# EasyEDA schematic IoT-Main Board.json
TITLE: Sheet_1; REV: 1.0; Date: 2023-12-27; Sheet: 1/1; Drawn By: Talha Ahmad; Company: Your Company
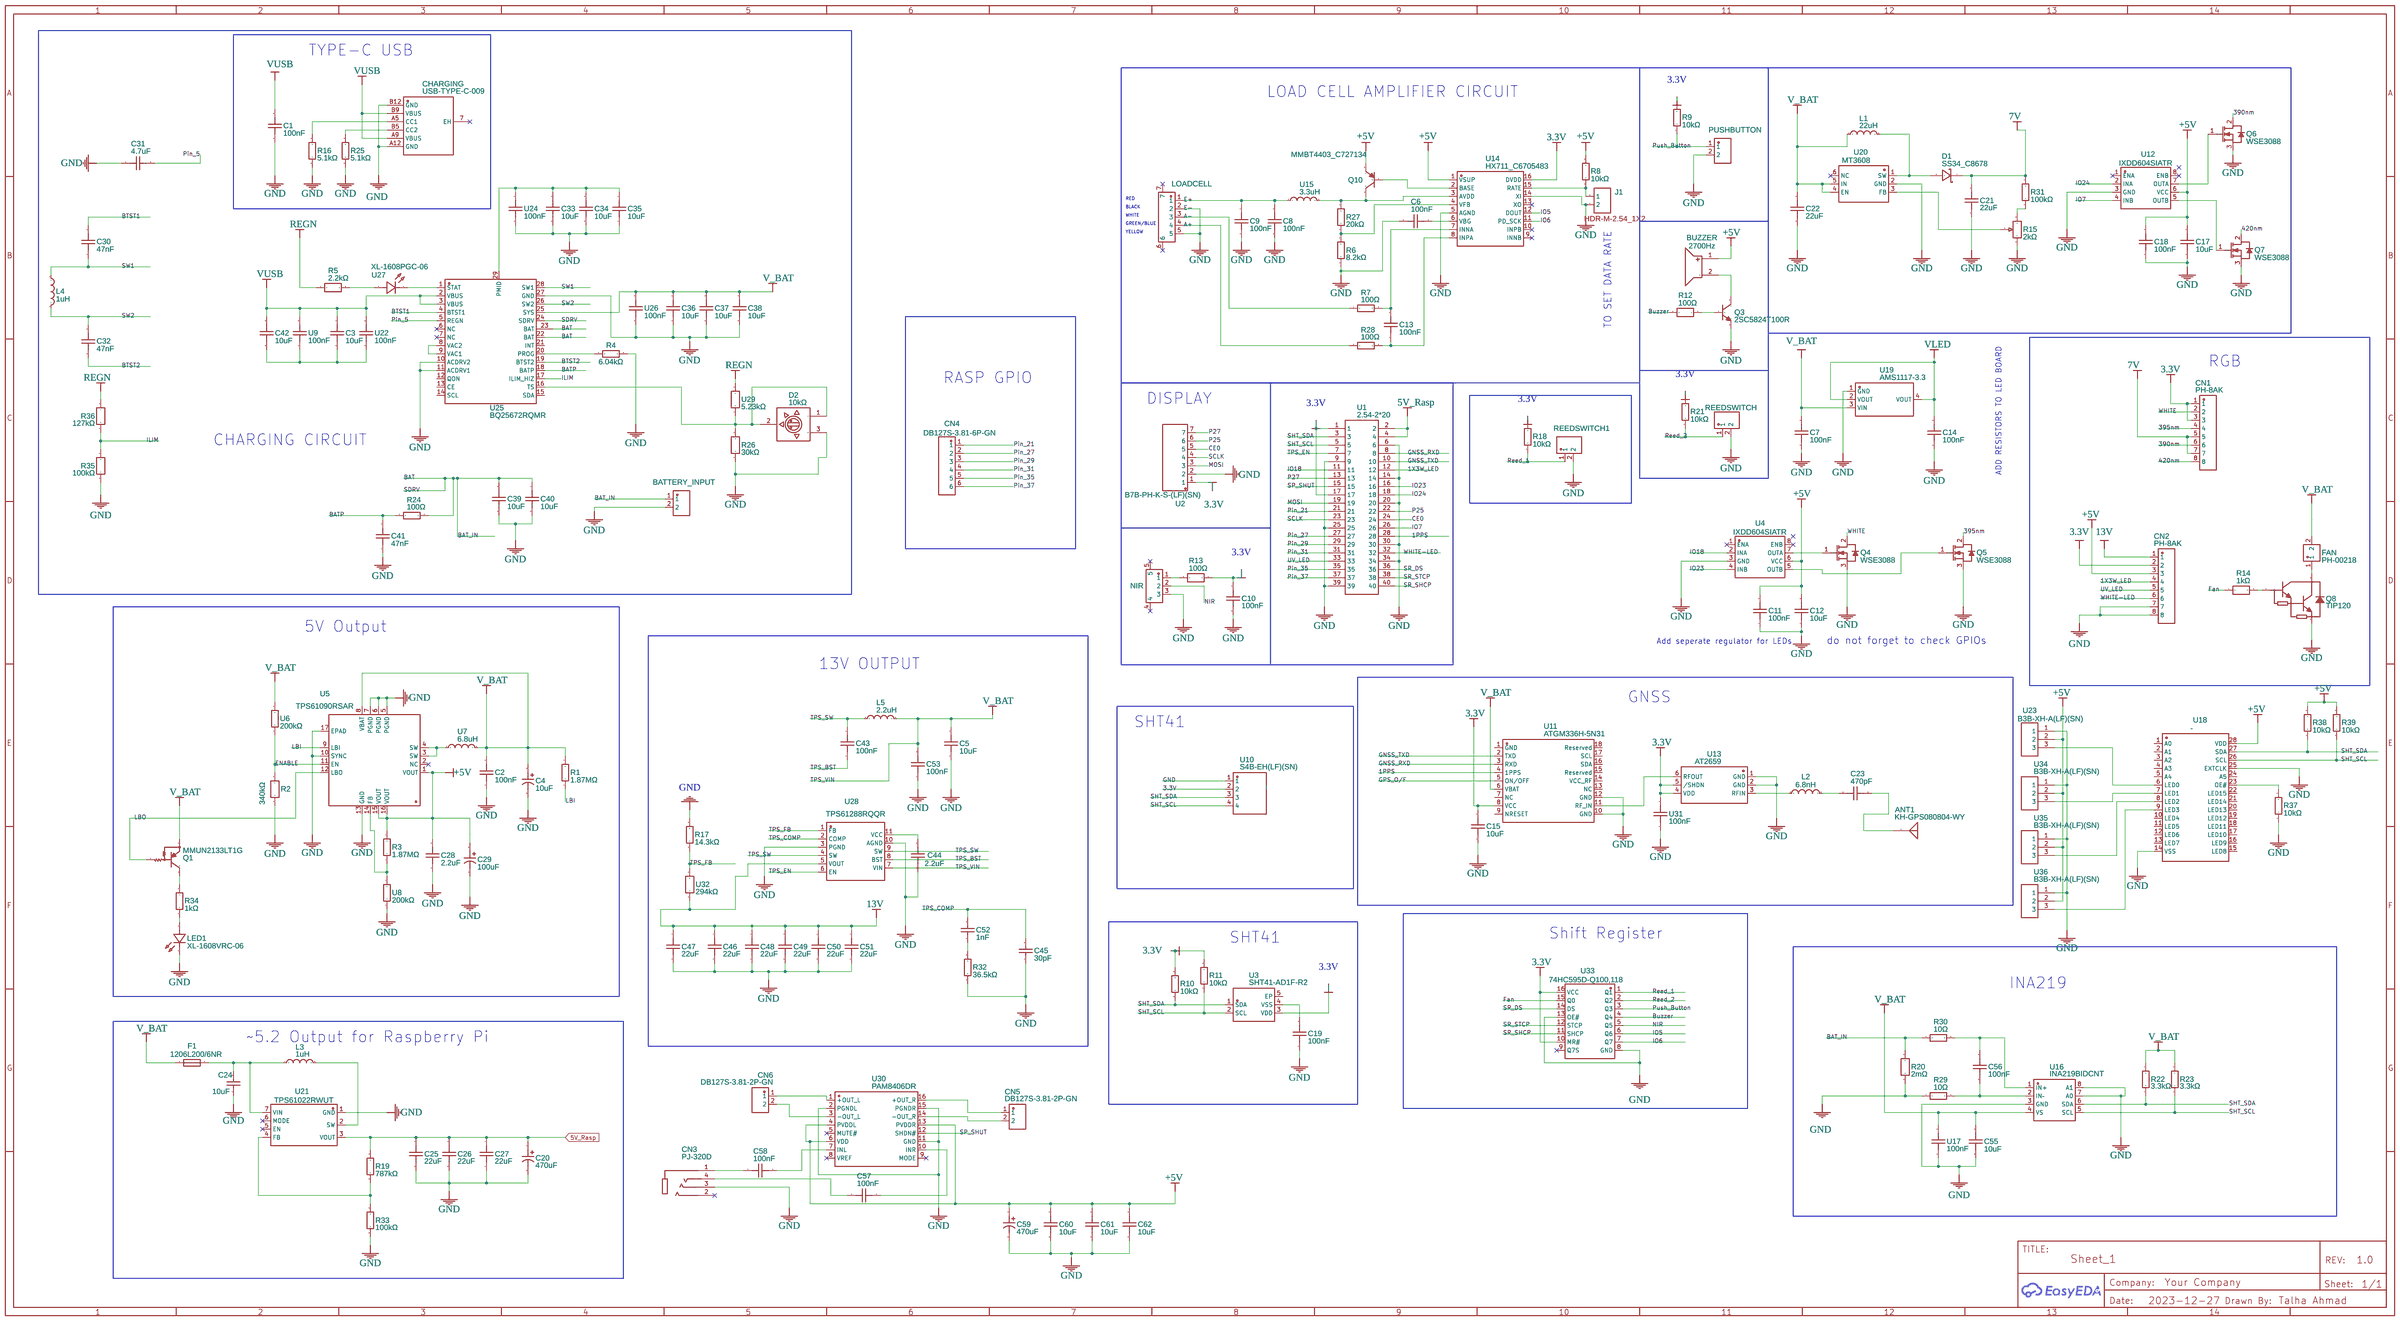
[diagram p0: schematic sheet]

## Parts
ANT1  KH-GPS080804-WY  [ANT-TH_L8.1-W8.1_KH-GPS121204-WY]
BATTERY_INPUT  PH-2A_C722767  [CONN-TH_PH-2A]
BUZZER  2700Hz  [BUZ-TH_BD9.0-P4.00-D0.6-FD]
C1  100nF  [C0603]
C2  100nF  [C0603]
C3  10uF  [C0603]
C4  10uF  [CAP-SMD_BD4.0-L4.3-W4.3-FD-LS5.3]
C5  10uF  [C0603]
C6  100nF  [C0603]
C7  100nF  [C0603]
C8  100nF  [C0603]
C9  100nF  [C0603]
C10  100nF  [C0603]
C11  100nF  [C0603]
C12  10uF  [C0603]
C13  100nF  [C0603]
C14  100nF  [C0603]
C15  10uF  [C0603]
C17  10uF  [C0603]
C18  100nF  [C0603]
C19  100nF  [C0603]
C20  470uF  [CAP-SMD_BD6.3-L6.6-W6.6-FD]
C21  22uF  [C0805]
C22  22uF  [C0805]
C23  470pF  [C0603]
C24  10uF  [C0603]
C25  22uF  [C0603]
C26  22uF  [C0603]
C27  22uF  [C0603]
C28  2.2uF  [C0402]
C29  100uF  [CAP-SMD_BD6.3-L6.6-W6.6-LS7.4-FD]
C30  47nF  [C0603]
C31  4.7uF  [C0603]
C32  47nF  [C0603]
C33  10uF  [C0603]
C34  10uF  [C0603]
C35  10uF  [C0603]
C36  10uF  [C0603]
C37  10uF  [C0603]
C38  10uF  [C0603]
C39  10uF  [C0603]
C40  10uF  [C0603]
C41  47nF  [C0603]
C42  10uF  [C0603]
C43  100nF  [C0603]
C44  2.2uF  [C0402]
C45  30pF  [C0402]
C46  22uF  [C0603]
C47  22uF  [C0603]
C48  22uF  [C0603]
C49  22uF  [C0603]
C50  22uF  [C0603]
C51  22uF  [C0603]
C52  1nF  [C0402]
C53  100nF  [C0603]
C55  10uF  [C0603]
C56  100nF  [C0603]
C57  100nF  [C0603]
C58  100nF  [C0603]
C59  470uF  [CAP-SMD_BD6.3-L6.6-W6.6-FD]
C60  10uF  [C0603]
C61  10uF  [C0603]
C62  10uF  [C0603]
CHARGING  USB-TYPE-C-009  [TYPE-C-SMD_TYPE-C-6P]
CN1  PH-8AK  [CONN-TH_8P-P2.00_PH-8AK_C8888]
CN2  PH-8AK  [CONN-TH_8P-P2.00_PH-8AK_C8888]
CN3  PJ-320D  [AUDIO-SMD_PJ-320D]
CN4  DB127S-3.81-6P-GN  [CONN-TH_6P-P3.81_DIBO_DB127S-3.81-6P-GN]
CN5  DB127S-3.81-2P-GN  [CONN-TH_2P-P3.81_DIBO_DB127S-3.81-2P-GN]
CN6  DB127S-3.81-2P-GN  [CONN-TH_2P-P3.81_DIBO_DB127S-3.81-2P-GN]
D1  SS34_C8678  [SMA_L4.3-W2.6-LS5.2-RD]
D2  10kΩ  [RES-ADJ-SMD_3314G-1-103E]
F1  1206L200/6NR  [F1206]
FAN  PH-00218  [HDR-TH_P2.54-V-M-R1-C2-S2.54]
J1  HDR-M-2.54_1x2  [HDR-M-2.54_1X2]
L1  22uH  [IND-SMD_L6.0-W6.0]
L2  6.8nH  [L0603]
L3  1uH  [L0402]
L4  1uH  [L0402]
L5  2.2uH  [L0603]
LED1  XL-1608VRC-06  [LED0603-RD_PINK]
LOADCELL  HC-FPC-05-10-5RLTAG  [FPC-SMD_5P-P0.50_HCTL_HC-FPC-05-10-5RLTAG]
NIR  1.0K-LS-3PWB  [FPC-SMD_3P-P1.00_HDGC_1.0K-LS-3PWB]
PUSHBUTTON  PH-2A_C722767  [CONN-TH_PH-2A]
Q1  MMUN2133LT1G  [SOT-23-3_L2.9-W1.6-P1.90-LS2.8-BR]
Q3  2SC5824T100R  [SOT-89-3_L4.5-W2.5-P1.50-LS4.2-TL]
Q4  WSE3088  [SOT-89-3_L4.5-W2.5-P1.50-LS4.2-BR]
Q5  WSE3088  [SOT-89-3_L4.5-W2.5-P1.50-LS4.2-BR]
Q6  WSE3088  [SOT-89-3_L4.5-W2.5-P1.50-LS4.2-BR]
Q7  WSE3088  [SOT-89-3_L4.5-W2.5-P1.50-LS4.2-BR]
Q8  TIP120  [TO-220-3_L10.0-W4.5-P2.54-L]
Q10  MMBT4403_C727134  [SOT-23-3_L2.9-W1.3-P1.90-LS2.4-BR]
R1  1.87MΩ  [R0603]
R2  340kΩ  [R0402]
R3  1.87MΩ  [R0603]
R4  6.04kΩ  [R0402]
R5  2.2kΩ  [R0603]
R6  8.2kΩ  [R0805]
R7  100Ω  [R0603]
R8  10kΩ  [R0603]
R9  10kΩ  [R0603]
R10  10kΩ  [R0603]
R11  10kΩ  [R0603]
R12  100Ω  [R0603]
R13  100Ω  [R0603]
R14  1kΩ  [R0603]
R15  2kΩ  [RES-ADJ-TH_3P-L7.1-W6.9-P2.50-L_3362P]
R16  5.1kΩ  [R1206]
R17  14.3kΩ  [R0402]
R18  10kΩ  [R0603]
R19  787kΩ  [R0603]
R20  2mΩ  [RES-SMD_L6.4-W3.2-1]
R21  10kΩ  [R0603]
R22  3.3kΩ  [R0402]
R23  3.3kΩ  [R0402]
R24  100Ω  [R0603]
R25  5.1kΩ  [R1206]
R26  30kΩ  [R0603]
R27  20kΩ  [R0805]
R28  100Ω  [R0603]
R29  10Ω  [R0402]
R30  10Ω  [R0402]
R31  100kΩ  [R0603]
R32  36.5kΩ  [R0603]
R33  100kΩ  [R0603]
R34  1kΩ  [R0603]
R35  100kΩ  [RES-SMD_L1.6-W0.8_LRE0603-2CR004F5]
R36  127kΩ  [R0603]
R37  10kΩ  [R0603]
R38  10kΩ  [R0603]
R39  10kΩ  [R0603]
REEDSWITCH  PH-2A_C722767  [CONN-TH_PH-2A]
REEDSWITCH1  PH-2A_C722767  [CONN-TH_PH-2A]
U1  2.54-2*20  [HDR-TH_40P-P2.54-V-F-R2-C20-S2.54]
U2  B7B-PH-K-S-(LF)(SN)  [CONN-TH_B7B-PH-K-S-LF-SN]
U3  SHT41-AD1F-R2  [DFN-4_L1.5-W1.5-P0.80-TL-EP]
U4  IXDD604SIATR  [SOIC-8_L5.0-W4.0-P1.27-LS6.0-BL]
U5  TPS61090RSAR  [QFN-16_L4.0-W4.0-P0.65-TL-EP2.7]
U6  200kΩ  [R0805]
U7  6.8uH  [IND-SMD_L4.5-W4.0]
U8  200kΩ  [R0805]
U9  100nF  [C1206]
U10  S4B-EH(LF)(SN)  [CONN-TH_S4B-EH-LF-SN]
U11  ATGM336H-5N31  [GPSM-SMD_ATGM336H-TR]
U12  IXDD604SIATR  [SOIC-8_L5.0-W4.0-P1.27-LS6.0-BL]
U13  AT2659  [DFN-6_L1.6-W1.0-P0.55-BL]
U14  HX711_C6705483  [SOP-16_L10.0-W3.9-P1.27-LS6.0-BL]
U15  3.3uH  [IND-SMD_L5.8-W5.2_CD54-4R7MT]
U16  INA219BIDCNT  [SOT-23-8_L2.9-W1.6-P0.65-LS2.8-BR]
U17  100nF  [C1206]
U18  -  [TSSOP-28_L9.7-W4.4-P0.65-LS6.4-BL]
U19  AMS1117-3.3  [SOT-223-3_L6.5-W3.4-P2.30-LS7.0-BR]
U20  MT3608  [SOT-23-6_L2.9-W1.6-P0.95-LS2.8-BL]
U21  TPS61022RWUT  [VQFN-7_L2.0-W2.0-P0.55-TL_RWU]
U22  100nF  [C1206]
U23  B3B-XH-A(LF)(SN)  [CONN-TH_3P-P2.50_A2501WV2-3P]
U24  100nF  [C1206]
U25  BQ25672RQMR  [VQFN-29_L4.0-W4.0-P0.40-BL]
U26  100nF  [C1206]
U27  XL-1608PGC-06  [LED0603-RD_GREEN]
U28  TPS61288RQQR  [VQFN-HR-11_L3.0-W2.5-P0.50-TL]
U29  5.23kΩ  [R0402]
U30  PAM8406DR  [SOIC-16_L9.9-W3.9-P1.27-LS6.0-BL]
U31  100nF  [C1206]
U32  294kΩ  [R0603]
U33  74HC595D-Q100,118  [SO-16_L9.9-W3.9-P1.27-LS6.0-BL]
U34  B3B-XH-A(LF)(SN)  [CONN-TH_3P-P2.50_A2501WV2-3P]
U35  B3B-XH-A(LF)(SN)  [CONN-TH_3P-P2.50_A2501WV2-3P]
U36  B3B-XH-A(LF)(SN)  [CONN-TH_3P-P2.50_A2501WV2-3P]

## Library data of the parts
ANT1 = KH-GPS080804-WY: Supplier: LCSC; Supplier Part: C962211; Manufacturer: kinghelm(金航标); JLCPCB Part Class: Extended Part; Contributor: lcsc
BATTERY_INPUT PUSHBUTTON REEDSWITCH REEDSWITCH1 = PH-2A_C722767: Contributor: LCSC; Supplier: LCSC; Supplier Part: C722767; Manufacturer: CAX(创都); Manufacturer Part: PH-2A; JLCPCB Part Class: Extended Part
BUZZER = QMB-09B-03: Contributor: LCSC; Supplier: LCSC; Manufacturer: 华能; Supplier Part: C96256; JLCPCB Part Class: Extended Part
C1 C2 C6-C11 C13 C14 C18 C19 C43 C53 C56-C58 = C0603B104K500NT: Supplier: LCSC; Supplier Part: C478888; Manufacturer: TORCH(火炬); Contributor: LCSC; JLCPCB Part Class: Extended Part
C3 C5 C15 C33-C40 C42 C55 C60-C62 = CL10A106KO8NQNC: Contributor: LCSC; Supplier: LCSC; Supplier Part: C962136; Manufacturer: SAMSUNG(三星); JLCPCB Part Class: Extended Part
C4 = EFVH025ADA100M0454: Supplier: LCSC; Supplier Part: C22387953; Manufacturer: FOLLON(富隆电子); JLCPCB Part Class: Extended Part; Contributor: lcsc
C12 C17 = CL10A106MA8NRNC: Supplier: LCSC; Manufacturer: SAMSUNG(三星); Supplier Part: C96446; JLCPCB Part Class: Basic Part
C20 C59 = RVE1A471M0605: Supplier: LCSC; Supplier Part: C7465562; Manufacturer: ROQANG(容强); Contributor: lcsc; JLCPCB Part Class: Extended Part
C21 C22 = CGA0805X5R226M350MT: Supplier: LCSC; Supplier Part: C6119901; Manufacturer: HRE(芯声); JLCPCB Part Class: Extended Part; Contributor: lcsc
C23 = CC0603KRX7R8BB471: Contributor: LCSC; Supplier: LCSC; Supplier Part: C519413; Manufacturer: YAGEO(国巨); JLCPCB Part Class: Extended Part
C24 = CL10A106MO8NQNC: Supplier: LCSC; Manufacturer: SAMSUNG(三星); Supplier Part: C92487; JLCPCB Part Class: Extended Part
C25-C27 C46-C51 = CL10A226MO7JZNC: Contributor: lcsc; Supplier: LCSC; Supplier Part: C2762594; Manufacturer: SAMSUNG(三星); JLCPCB Part Class: Extended Part
C28 = GRM155R61E225KE11D: Contributor: LCSC; Supplier: LCSC; Supplier Part: C385032; Manufacturer: muRata(村田)
C29 = FVM025ADA101M0654: Supplier: LCSC; Supplier Part: C7469933; Manufacturer: FOSAN(富信); Contributor: lcsc; JLCPCB Part Class: Extended Part
C30 C32 C41 = TCC0603X7R473M500CT: Contributor: LCSC; Supplier: LCSC; Supplier Part: C696860; Manufacturer: CCTC(三环); JLCPCB Part Class: Extended Part
C31 = TCC0603X5R475M250CT: Supplier: LCSC; Supplier Part: C20539423; Manufacturer: CCTC(三环); JLCPCB Part Class: Extended Part; Contributor: lcsc
C44 = EMK105ABJ225KV-F: Contributor: LCSC; Supplier: LCSC; Supplier Part: C385887; Manufacturer: TAIYO YUDEN(太诱)
C45 = CC0402JRNPO9BN300: Supplier: LCSC; Manufacturer: YAGEO(国巨); Supplier Part: C107004; JLCPCB Part Class: Extended Part
C52 = CC0402KRX7R9BB102: Contributor: LCSC; Supplier: LCSC; Manufacturer: YAGEO(国巨); Supplier Part: C106205; JLCPCB Part Class: Extended Part
CHARGING = USB-TYPE-C-009: Contributor: lcsc; Supplier: LCSC; Supplier Part: C2927029; Manufacturer: DEALON(德艺隆); JLCPCB Part Class: Extended Part
CN1 CN2 = PH-8AK: Supplier: LCSC; Manufacturer: BOOMELE(博穆精密); Supplier Part: C8888; JLCPCB Part Class: Extended Part
CN3 = PJ-320D: Contributor: LCSC; Supplier: LCSC; Supplier Part: C431535; Manufacturer: SHOU HAN(首韩); JLCPCB Part Class: Extended Part
CN4 = DB127S-3.81-6P-GN: Contributor: lcsc; Supplier: LCSC; Supplier Part: C2997518; Manufacturer: DORABO(地博电气); Manufacturer Part: DB127S-3.81-6P-GN-S; JLCPCB Part Class: Extended Part
CN5 CN6 = DB127S-3.81-2P-GN: Contributor: lcsc; Supplier: LCSC; Supplier Part: C2997514; Manufacturer: DORABO(地博电气); Manufacturer Part: DB127S-3.81-2P-GN-S
D1 = SS34_C8678: Supplier: LCSC; Manufacturer Part: SS34; Manufacturer: MDD; Supplier Part: C8678; JLCPCB Part Class: Basic Part
D2 = 3314G-1-103E: Contributor: LCSC; Supplier: LCSC; Supplier Part: C780220; Manufacturer: BOURNS; JLCPCB Part Class: Extended Part
F1 = 1206L200/6NR: Supplier: LCSC; Supplier Part: C19078715; Manufacturer: LUTE(陆特); JLCPCB Part Class: Extended Part; Contributor: lcsc
FAN = PH-00218: Contributor: LCSC; Supplier: LCSC; Supplier Part: C2685144; Manufacturer: Liansheng(连盛); JLCPCB Part Class: Extended Part
J1 = HDR-M-2.54_1x2: Supplier Part: C124375; Supplier: LCSC; Contributor: LCEDA_Lib; Package Display: Yes
L1 = PNLS6045-220M 22UH: Supplier: LCSC; Supplier Part: C2849539; Manufacturer: DMBJ(振宝佳); JLCPCB Part Class: Extended Part; Contributor: lcsc
L2 = CMCC1608C6N8JSP: Contributor: LCSC; Supplier: LCSC; Supplier Part: C405061; Manufacturer: Cybermax(思博科技); JLCPCB Part Class: Extended Part
L3 L4 = MLZ1005M1R0WT000: Contributor: LCSC; Supplier: LCSC; Supplier Part: C531288; Manufacturer: TDK; JLCPCB Part Class: Extended Part
L5 = MLZ1608N2R2LT000: Contributor: LCSC; Supplier: LCSC; Supplier Part: C531282; Manufacturer: TDK; JLCPCB Part Class: Extended Part
LED1 = XL-1608VRC-06: Supplier: LCSC; Supplier Part: C7371906; Manufacturer: XINGLIGHT(成兴光); JLCPCB Part Class: Extended Part; Contributor: lcsc
LOADCELL = HC-FPC-05-10-5RLTAG: Contributor: lcsc; Supplier: LCSC; Supplier Part: C5213728; Manufacturer: HCTL(华灿天禄); JLCPCB Part Class: Extended Part
NIR = 1.0K-LS-3PWB: Contributor: LCSC; Supplier: LCSC; Supplier Part: C2915456; Manufacturer: HDGC(华德共创); JLCPCB Part Class: Extended Part
Q1 = MMUN2133LT1G: Supplier: LCSC; Manufacturer: onsemi(安森美); Supplier Part: C86182; JLCPCB Part Class: Extended Part
Q3 = 2SC5824T100R: Supplier: LCSC; Manufacturer: ROHM(罗姆); Supplier Part: C126304; JLCPCB Part Class: Extended Part
Q4-Q7 = WSE3088: Supplier: LCSC; Supplier Part: C148358; Manufacturer: WINSOK(微硕); Contributor: LCSC; JLCPCB Part Class: Extended Part
Q8 = TIP120_C2992069: Contributor: lcsc; Supplier: LCSC; Supplier Part: C2992069; Manufacturer: CJ(江苏长电/长晶); JLCPCB Part Class: Extended Part
Q10 = MMBT4403_C727134: Contributor: LCSC; Supplier: LCSC; Supplier Part: C727134; Manufacturer: TWGMC(台湾迪嘉); Manufacturer Part: MMBT4403; JLCPCB Part Class: Extended Part
R1 R3 = 0603WAF1874T5E: Supplier: LCSC; Manufacturer: UNI-ROYAL(厚声); Supplier Part: C61679; JLCPCB Part Class: Extended Part
R2 = RC0402FR-07340KL: Contributor: LCSC; Supplier: LCSC; Supplier Part: C273336; Manufacturer: YAGEO(国巨); JLCPCB Part Class: Extended Part
R4 = RC0402FR-076K04L: Contributor: LCSC; Supplier: LCSC; Supplier Part: C97819; Manufacturer: YAGEO(国巨); JLCPCB Part Class: Extended Part
R5 = ERJUP3J222V: Contributor: LCSC; Supplier: LCSC; Supplier Part: C491201; Manufacturer: PANASONIC(松下); JLCPCB Part Class: Extended Part
R6 = RC0805JR-078K2L: Supplier: LCSC; Manufacturer: YAGEO(国巨); Supplier Part: C137399; JLCPCB Part Class: Extended Part
R7 R24 R28 = ESR03EZPJ101: Contributor: LCSC; Supplier: LCSC; Supplier Part: C253328; Manufacturer: ROHM(罗姆); JLCPCB Part Class: Extended Part
R8-R11 R18 R21 R37-R39 = ERA-3AEB103V: Contributor: LCSC; Supplier: LCSC; Supplier Part: C190610; Manufacturer: PANASONIC(松下); Manufacturer Part: ERA3AEB103V; JLCPCB Part Class: Extended Part
R12 R13 = ERJP03F1000V: Contributor: LCSC; Supplier: LCSC; Supplier Part: C427297; Manufacturer: PANASONIC(松下); JLCPCB Part Class: Extended Part
R14 = ERJUP3F1001V: Contributor: LCSC; Supplier: LCSC; Supplier Part: C491209; Manufacturer: PANASONIC(松下)
R15 = 3362P-1-202_C118929: Resistance(Ohms): 2K; Contributor: LCSC; Supplier: LCSC; Supplier Part: C118929; Manufacturer: BOCHEN(博晨); Manufacturer Part: 3362P-1-202; JLCPCB Part Class: Extended Part
R16 R25 = RC1206JR-075K1L: Contributor: LCSC; Supplier: LCSC; Manufacturer: YAGEO(国巨); Supplier Part: C131050; JLCPCB Part Class: Extended Part
R17 = RK73H1ETTP1432F: Contributor: LCSC; Supplier: LCSC; Supplier Part: C159950; Manufacturer: KOA; JLCPCB Part Class: Extended Part
R19 = CR0603F787KP05: Contributor: LCSC; Supplier: LCSC; Supplier Part: C245168; Manufacturer: EVER OHMS(天二科技); Manufacturer Part: CR0603F787KP05Z; JLCPCB Part Class: Extended Part
R20 = HOLLR2512-3W-2MR-1%: Contributor: lcsc; Supplier: LCSC; Supplier Part: C2994640; Manufacturer: Milliohm(毫欧); Manufacturer Part: HoLLR2512-3W-2mR-1%; JLCPCB Part Class: Extended Part
R22 R23 = RC0402FR-073K3L: Supplier: LCSC; Manufacturer: YAGEO(国巨); Supplier Part: C137992; JLCPCB Part Class: Extended Part
R26 = FRC0603F3002TS: Contributor: lcsc; Supplier: LCSC; Supplier Part: C2907025; Manufacturer: FOJAN(富捷); JLCPCB Part Class: Extended Part
R27 = RC0805JR-0720KL: Contributor: LCSC; Supplier: LCSC; Manufacturer: YAGEO(国巨); Supplier Part: C114233
R29 R30 = RC0402FR-0710RL: Supplier: LCSC; Manufacturer: YAGEO(国巨); Supplier Part: C138066; JLCPCB Part Class: Extended Part
R31 = ERJPB3D1003V: Contributor: LCSC; Supplier: LCSC; Supplier Part: C189496; Manufacturer: PANASONIC(松下); JLCPCB Part Class: Extended Part
R32 = RC0603FR-0736K5L: Supplier: LCSC; Manufacturer: YAGEO(国巨); Supplier Part: C137738; JLCPCB Part Class: Extended Part
R33 = RC0603FR-07100KL: Contributor: LCSC; Supplier: LCSC; Supplier Part: C14675; Manufacturer: YAGEO(国巨); JLCPCB Part Class: Extended Part
R34 = ESR03EZPJ102: Contributor: LCSC; JLCPCB Part Class: Extended Part; Supplier: LCSC; Supplier Part: C253329; Manufacturer: ROHM(罗姆)
R35 = CRCW0603100KFKEAHP: Supplier: LCSC; Supplier Part: C313647; Manufacturer: VISHAY(威世); JLCPCB Part Class: Extended Part; Contributor: lcsc
R36 = FRC0603F1273TS: Supplier: LCSC; Supplier Part: C2930062; Manufacturer: FOJAN(富捷); JLCPCB Part Class: Extended Part; Contributor: lcsc
U1 = 2.54-2*20: Contributor: LCSC; Supplier: LCSC; Supplier Part: C2977589; Manufacturer: ZHOURI(洲日); JLCPCB Part Class: Extended Part
U2 = B7B-PH-K-S-(LF)(SN): Contributor: LCSC; Supplier: LCSC; Supplier Part: C157981; Manufacturer: JST; Manufacturer Part: B7B-PH-K-S(LF)(SN)
U3 = SHT41-AD1F-R2: Supplier: LCSC; Supplier Part: C7461862; Manufacturer: Sensirion(瑞士盛思锐); Contributor: lcsc; Package Display: No
U4 U12 = IXDD604SIATR: Contributor: LCSC; Supplier: LCSC; Supplier Part: C2676942; Manufacturer: Littelfuse/IXYS; JLCPCB Part Class: Extended Part
U5 = TPS61090RSAR: Contributor: LCSC; Supplier: LCSC; Supplier Part: C206167; Manufacturer: TI(德州仪器); JLCPCB Part Class: Extended Part
U6 U8 = RTT052003FTP: Supplier: LCSC; Manufacturer: RALEC(旺诠); Supplier Part: C104082; JLCPCB Part Class: Extended Part
U7 = CY43-6.8UH: Contributor: lcsc; Supplier: LCSC; Supplier Part: C2929418; Manufacturer: SHOU HAN(首韩); JLCPCB Part Class: Extended Part
U9 U17 U22 U24 U26 U31 = CL31B104KBCNFNC: Supplier: LCSC; Supplier Part: C346231; Manufacturer: SAMSUNG(三星); JLCPCB Part Class: Extended Part; Contributor: lcsc
U10 = S4B-EH(LF)(SN): Contributor: LCSC; Supplier: LCSC; Supplier Part: C265068; Manufacturer: JST; JLCPCB Part Class: Extended Part
U11 = ATGM336H-5N31: Supplier: LCSC; Manufacturer: 杭州中科微; Supplier Part: C90770; JLCPCB Part Class: Extended Part
U13 = AT2659: Supplier: LCSC; Manufacturer: ZHONGKEWEI; Supplier Part: C92450; Contributor: armex; JLCPCB Part Class: Extended Part
U14 = HX711_C6705483: Contributor: lcsc; Supplier: LCSC; Supplier Part: C6705483; Manufacturer: AVIA(海芯科技); Manufacturer Part: HX711; JLCPCB Part Class: Extended Part
U15 = CY54-3.3UH: Contributor: lcsc; Supplier: LCSC; Supplier Part: C2929428; Manufacturer: SHOU HAN(首韩)
U16 = INA219BIDCNT: Contributor: lcsc; Supplier: LCSC; Supplier Part: C2653868; Manufacturer: TI(德州仪器); JLCPCB Part Class: Extended Part
U18 = PCA9685PW/Q900,118: Supplier: LCSC; Manufacturer: NXP(恩智浦); Supplier Part: C92206; JLCPCB Part Class: Extended Part
U19 = AMS1117-3.3: sourceId: dwIGgezVh; Supplier: LCSC; Manufacturer: AMS; Supplier Part: C6186; JLCPCB Part Class: Basic Part
U20 = MT3608: Supplier: LCSC; Manufacturer: 西安航天民芯; Supplier Part: C84817; JLCPCB Part Class: Extended Part
U21 = TPS61022RWUT: Contributor: LCSC; Supplier: LCSC; Supplier Part: C2071784; Manufacturer: TI(德州仪器); JLCPCB Part Class: Extended Part
U23 U34-U36 = B3B-XH-A(LF)(SN): Contributor: LCSC; Supplier: LCSC; Supplier Part: C144394; Manufacturer: JST; JLCPCB Part Class: Extended Part
U25 = BQ25672RQMR: Contributor: lcsc; Supplier: LCSC; Supplier Part: C3682029; Manufacturer: TI(德州仪器); JLCPCB Part Class: Extended Part
U27 = XL-1608PGC-06: Supplier: LCSC; Supplier Part: C7371905; Manufacturer: XINGLIGHT(成兴光); JLCPCB Part Class: Extended Part; Contributor: lcsc
U28 = TPS61288RQQR: Contributor: lcsc; Supplier: LCSC; Supplier Part: C5219223; Manufacturer: TI(德州仪器); JLCPCB Part Class: Extended Part
U29 = CRCW04025K23FKED: Supplier: LCSC; Supplier Part: C2076550; Manufacturer: VISHAY(威世); JLCPCB Part Class: Extended Part; Contributor: lcsc
U30 = PAM8406DR: Contributor: LCSC; Supplier: LCSC; Manufacturer: DIODES(美台); Supplier Part: C86270; JLCPCB Part Class: Extended Part
U32 = RT0603BRD07294KL: Supplier: LCSC; Supplier Part: C861286; Manufacturer: YAGEO(国巨); JLCPCB Part Class: Extended Part; Contributor: lcsc
U33 = 74HC595D-Q100,118: Contributor: LCSC; Supplier: LCSC; Supplier Part: C547127; Manufacturer: Nexperia(安世); JLCPCB Part Class: Extended Part

## Nets
3.3V: C10.1 C15.2 CN1.1 CN1.3 CN2.2 R9.2 R10.2 R11.2 R13.1 R18.2 R21.2 U1.1 U1.17 U2.1 U3.3(VDD) U10.2 U11.8(VCC) U13.4(VDD) U13.5(/SHDN) U14.16(DVDD) U31.2 U33.10(MR#) U33.16(VCC)
5V_Rasp: C20.1 C25.1 C26.1 C27.1 R19.2 U1.2 U1.4 U21.3(VOUT)
7V: C21.2 CN1.5 CN1.7 D1.1(K) R31.2
13V: C46.1 C47.1 C48.1 C49.1 C50.1 C51.1 CN2.1 U28.5(VOUT) U32.1
+5V: BUZZER.1 C11.2 C12.2 C17.2 C18.2 C28.2 C29.1 C59.1 C60.1 C61.1 C62.1 CN2.3 Q10.2(E) R3.2 R8.2 R38.2 R39.2 U4.6(VCC) U5.1(VOUT) U5.15(VOUT) U5.16(VOUT) U12.6(VCC) U14.1(VSUP) U18.28(VDD) U23.2 U30.4(PVDDL) U30.6(VDD) U30.13(PVDDR) U34.2 U35.2 U36.2
1PPS: U1.28 U11.4(1PPS)
1X3W_LED: CN2.4 U1.12
390nm: CN1.6 Q6.2(D)
395nm: CN1.4 Q5.2(D)
420nm: CN1.8 Q7.2(D)
A+: LOADCELL.4 R28.1
A-: LOADCELL.3 R7.1
BAT: BATTERY_INPUT.1 C39.1 C40.1 R20.2 R24.2 R30.1 U25.22(BAT) U25.23(BAT) U25.24(SDRV)
BATP: C41.2 R24.1 U25.18(BATP)
BTST1: C30.2 U25.4(BTST1)
BTST2: C32.1 U25.19(BTST2)
Buzzer: R12.2 U33.4(Q4)
CE0: U1.24 U2.5
E+: C8.2 C9.2 LOADCELL.1 U15.1
E-: BATTERY_INPUT.2 C1.1 C2.1 C4.2 C5.2 C6.2 C7.1 C8.1 C9.1 C10.2 C11.1 C12.1 C14.1 C15.1 C17.1 C18.1 C19.1 C20.2 C21.1 C22.1 C24.1 C25.2 C26.2 C27.2 C28.1 C29.2 C31.1 C33.2 C34.2 C35.2 C36.2 C37.2 C38.2 C39.2 C40.2 C41.1 C44.1 C45.1 C46.2 C47.2 C48.2 C49.2 C50.2 C51.2 C53.1 C55.2 C59.2 C60.2 C61.2 C62.2 CHARGING.A12(GND) CHARGING.B12(GND) CN2.7 CN2.8 CN3.3 D2.3 J1.2 LED1.1(K) LOADCELL.2 LOADCELL.5 NIR.3 PUSHBUTTON.2 Q3.3(E) Q4.3(S) Q5.3(S) Q6.3(S) Q7.3(S) Q8.3(E) R2.1 R4.2 R6.1 R15.1 R16.1 R17.2 R20.1 R25.1 R26.1 R29.1 R32.1 R33.1 R35.1 R37.1 REEDSWITCH.2 REEDSWITCH1.2 U1.6 U1.9 U1.14 U1.20 U1.25 U1.30 U1.34 U1.39 U2.2 U4.3(GND) U5.5(PGND) U5.6(PGND) U5.7(PGND) U5.10(SYNC) U5.13(GND) U5.17(EPAD) U8.1 U10.1 U11.10(GND) U11.12(GND) U12.3(GND) U13.1(GND) U13.2(GND) U14.5(AGND) U14.14(XI) U16.3(GND) U16.7(A0) U16.8(A1) U17.1 U18.14(VSS) U18.25(EXTCLK) U19.1(GND) U20.2(GND) U21.1(GND) U23.1 U24.1 U25.10(ACDRV2) U25.11(ACDRV1) U25.27(GND) U26.1 U28.3(PGND) U28.10(AGND) U30.2(PGNDL) U30.11(GND) U30.15(PGNDR) U31.1 U33.8(GND) U33.13(OE#) U34.1 U35.1 U36.1
ENABLE: R2.2 U5.11(EN) U6.1
Fan: R14.1 U33.15(Q0)
GNSS_RXD: U1.8 U11.3(RXD)
GNSS_TXD: U1.10 U11.2(TXD)
GPS_O/F: U11.5(ON/OFF)
ILIM: R35.2 R36.2 U25.17(ILIM_HIZ)
IO5: U14.12(DOUT) U33.6(Q6)
IO6: U14.11(PD_SCK) U33.7(Q7)
IO7: U1.26 U12.4(INB)
IO18: U1.11 U4.2(INA)
IO23: U1.16 U4.4(INB)
IO24: U1.18 U12.2(INA)
LBI: R1.1 U5.9(LBI)
LBO: Q1.1(B) U5.12(LBO)
MOSI: U1.19 U2.3
NIR: NIR.2 U33.5(Q5)
P25: U1.22 U2.6
P27: U1.13 U2.7
Pin_5: C31.2 U25.5(REGN)
Pin_21: CN4.1 U1.21
Pin_27: CN4.2 U1.27
Pin_29: CN4.3 U1.29
Pin_31: CN4.4 U1.31
Pin_35: CN4.5 U1.35
Pin_37: CN4.6 U1.37
Push_Button: PUSHBUTTON.1 R9.1 U33.3(Q3)
Reed_1: R18.1 REEDSWITCH1.1 U33.1(Q1)
Reed_2: R21.1 REEDSWITCH.1 U33.2(Q2)
REGN: R5.1 R36.1 U29.2
SCLK: U1.23 U2.4
SHT_SCL: R11.1 R23.1 R39.1 U1.5 U3.2(SCL) U10.4 U16.5(SCL) U18.26(SCL)
SHT_SDA: R10.1 R22.1 R38.1 U1.3 U3.1(SDA) U10.3 U16.6(SDA) U18.27(SDA)
SP_SHUT: U1.15 U30.12(SHDN#)
SR_DS: U1.36 U33.14(DS)
SR_SHCP: U1.40 U33.11(SHCP)
SR_STCP: U1.38 U33.12(STCP)
SW1: C30.1 L4.1 U25.28(SW1)
SW2: C32.2 L4.2 U25.26(SW2)
TPS_BST: C43.1 U28.8(BST)
TPS_COMP: C45.2 C52.2 U28.2(COMP)
TPS_EN: U1.7 U28.6(EN)
TPS_FB: R17.1 U28.1(FB) U32.2
TPS_SW: C43.2 L5.1 U28.4(SW) U28.9(SW)
TPS_VIN: C2.2 C4.1 C5.1 C7.2 C22.2 C36.1 C37.1 C38.1 C53.2 C55.1 F1.1 FAN.2 L1.1 L5.2 Q1.2(E) R1.2 R22.2 R23.2 U5.8(VBAT) U6.2 U7.2 U11.6(VBAT) U16.4(VS) U17.2 U19.3(VIN) U20.4(EN) U20.5(IN) U25.25(SYS) U26.2 U28.7(VIN)
UV_LED: CN2.5 U1.33
VLED: C14.2 U19.2(VOUT) U19.4(VOUT)
VUSB: C1.2 C3.1 C42.1 CHARGING.A9(VBUS) CHARGING.B9(VBUS) U9.2 U22.2 U25.2(VBUS) U25.3(VBUS)
WHITE: CN1.2 Q4.2(D)
WHITE-LED: CN2.6 U1.32
Net-(ANT1-1): ANT1.1 C23.2
Net-(BUZZER-2): BUZZER.2 Q3.2(C)
Net-(C3-2): C3.2 C42.2 U9.1 U22.1
Net-(C6-1): C6.1 U14.6(VBG)
Net-(C13-1): C13.1 R28.2 U14.8(INPA)
Net-(C13-2): C13.2 R7.2 U14.7(INNA)
Net-(C19-2): C19.2 U3.4(VSS)
Net-(C23-1): C23.1 L2.2
Net-(C24-2): C24.2 F1.2 L3.1 U21.7(VIN)
Net-(C33-1): C33.1 C34.1 C35.1 U24.2 U25.29(PMID)
Net-(C44-2): C44.2 U28.11(VCC)
Net-(C52-1): C52.1 R32.2
Net-(C56-1): C56.1 R30.2 U16.1(IN+)
Net-(C56-2): C56.2 R29.2 U16.2(IN–)
Net-(C57-1): C57.1 U30.10(INR)
Net-(C57-2): C57.2 CN3.4
Net-(C58-1): C58.1 U30.7(INL)
Net-(C58-2): C58.2 CN3.1
Net-(CHARGING-A5): CHARGING.A5(CC1) R16.2
Net-(CHARGING-B5): CHARGING.B5(CC2) R25.2
Net-(CN5-1): CN5.1 U30.16(+OUT_R)
Net-(CN5-2): CN5.2 U30.14(-OUT_R)
Net-(CN6-1): CN6.1 U30.1(+OUT_L)
Net-(CN6-2): CN6.2 U30.3(-OUT_L)
Net-(D1-2): D1.2(A) L1.2 U20.1(SW)
Net-(D2-1): D2.1 D2.2 R26.2 U25.16(TS) U29.1
Net-(FAN-1): FAN.1 Q8.2(C)
Net-(J1-1): J1.1 R8.1 U14.15(RATE)
Net-(L2-1): L2.1 U13.3(RFIN)
Net-(L3-2): L3.2 U21.2(SW)
Net-(LED1-2): LED1.2(A) R34.1
Net-(NIR-1): NIR.1 R13.2
Net-(Q1-3): Q1.3(C) R34.2
Net-(Q3-1): Q3.1(B) R12.1
Net-(Q4-1): Q4.1(G) U4.7(OUTA)
Net-(Q5-1): Q5.1(G) U4.5(OUTB)
Net-(Q6-1): Q6.1(G) U12.7(OUTA)
Net-(Q7-1): Q7.1(G) U12.5(OUTB)
Net-(Q8-1): Q8.1(B) R14.2
Net-(Q10-1): Q10.1(B) U14.2(BASE)
Net-(Q10-3): Q10.3(C) R27.2 U14.3(AVDD) U15.2
Net-(R3-1): R3.1 U5.14(FB) U8.2
Net-(R4-1): R4.1 U25.20(PROG)
Net-(R5-2): R5.2 U27.2(A)
Net-(R6-2): R6.2 R27.1 U14.4(VFB)
Net-(R15-2): R15.2 U20.3(FB)
Net-(R15-3): R15.3 R31.1
Net-(R19-1): R19.1 R33.2 U21.4(FB)
Net-(R37-2): R37.2 U18.23(OE#)
Net-(U5-3): U5.3(SW) U5.4(SW) U7.1
Net-(U11-11): U11.11(RF_IN) U13.6(RFOUT)
Net-(U18-6): U18.6(LED0) U23.3
Net-(U18-7): U18.7(LED1) U34.3
Net-(U18-8): U18.8(LED2) U35.3
Net-(U18-9): U18.9(LED3) U36.3
Net-(U25-1): U25.1(STAT) U27.1(K)
Net-(U25-8): U25.8(VAC2) U25.9(VAC1)

Not connected (* = marked no-connect by the designer): CHARGING 7(EH)*; CN3 2*; LOADCELL 6* 7*; NIR 4* 5*; U3 5(EP); U4 1(ENA)* 8(ENB)*; U5 2(NC)*; U11 1(GND) 7(NC) 9(NRESET) 13(NC) 14(VCC_RF) 15(Reserved) 16(SDA) 17(SCL) 18(Reserved); U12 1(ENA)* 8(ENB)*; U14 9(INNB)* 10(INPB)* 13(XO)*; U18 1(A0) 2(A1) 3(A2) 4(A3) 5(A4) 10(LED4) 11(LED5) 12(LED6) 13(LED7) 15(LED8) 16(LED9) 17(LED10) 18(LED11) 19(LED12) 20(LED13) 21(LED14) 22(LED15) 24(A5); U20 6(NC)*; U21 5(EN)* 6(MODE)*; U25 6(NC)* 7(NC)* 12(QON) 13(CE) 14(SCL) 15(SDA) 21(INT); U30 5(MUTE#)* 8(VREF)* 9(MODE)*; U33 9(Q7S)*

## Notes on the sheet
- TYPE-C USB
- LOAD CELL AMPLIFIER CIRCUIT
- BLACK
- RED
- WHITE
- GREEN/BLUE
- YELLOW
- TO SET DATA RATE
- RGB
- RASP GPIO
- DISPLAY
- CHARGING CIRCUIT
- ADD RESISTORS TO LED BOARD
- 5V Output
- do not forget to check GPIOs
- Add seperate regulator for LEDs
- 13V OUTPUT
- GNSS
- SHT41
- Shift Register
- SHT41
- INA219
- ~5.2 Output for Raspberry Pi
